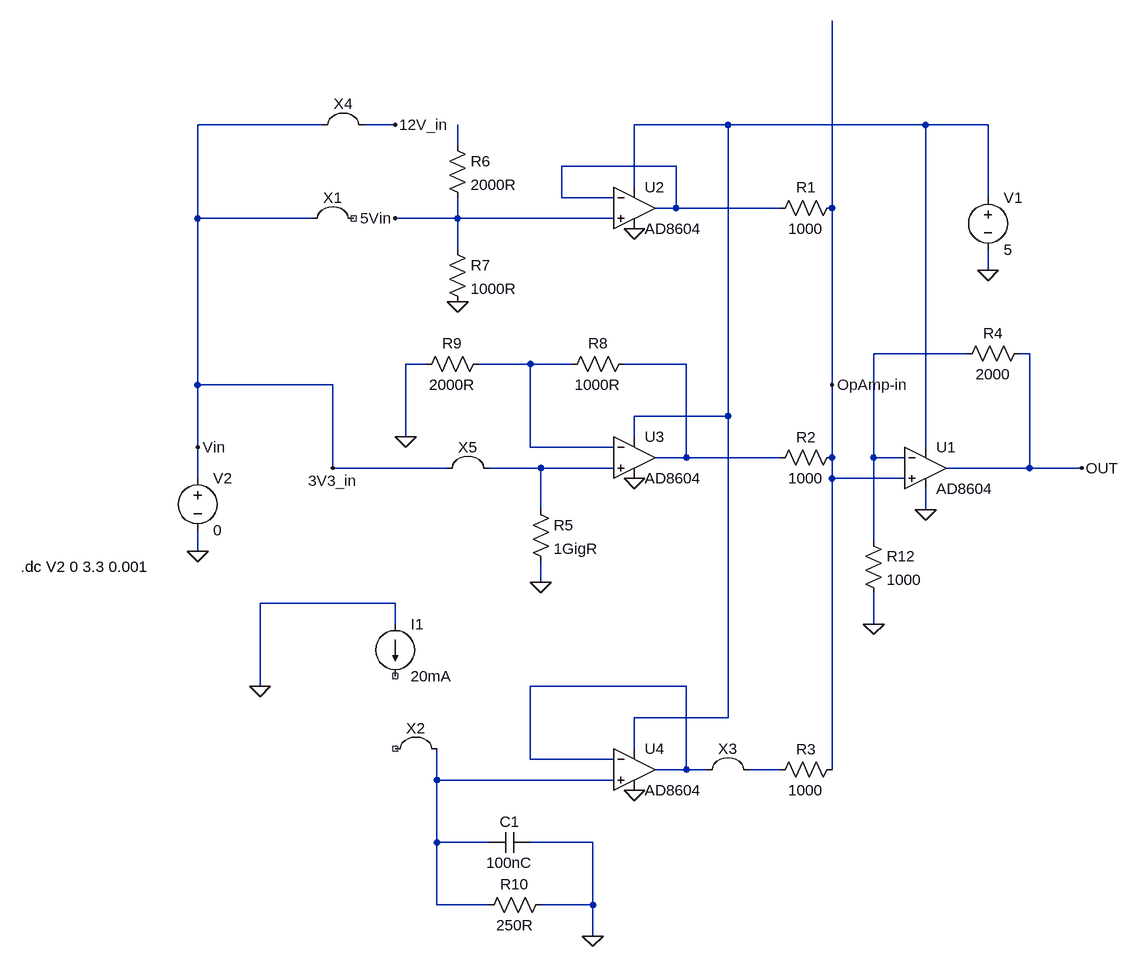
[diagram p0: schematic LM234-OpAmp-LTSpice.asc]
LM234-OpAmp-LTSpice.asc, the LTspice schematic file:
Version 4
SHEET 1 1060 1028
WIRE -432 -384 -624 -384
WIRE -320 -384 -368 -384
WIRE 192 -384 48 -384
WIRE 496 -384 192 -384
WIRE 592 -384 496 -384
WIRE -224 -352 -224 -384
WIRE 112 -320 -64 -320
WIRE 48 -288 48 -384
WIRE -64 -272 -64 -320
WIRE 16 -272 -64 -272
WIRE 592 -272 592 -384
WIRE 112 -256 112 -320
WIRE 112 -256 80 -256
WIRE 272 -256 112 -256
WIRE 352 -256 352 -544
WIRE -624 -240 -624 -384
WIRE -448 -240 -624 -240
WIRE -224 -240 -224 -272
WIRE -224 -240 -320 -240
WIRE 16 -240 -224 -240
WIRE -224 -192 -224 -240
WIRE 592 -160 592 -192
WIRE 560 -32 416 -32
WIRE 656 -32 640 -32
WIRE -272 -16 -304 -16
WIRE -112 -16 -192 -16
WIRE -48 -16 -112 -16
WIRE 128 -16 32 -16
WIRE -624 16 -624 -240
WIRE -416 16 -624 16
WIRE 352 16 352 -256
WIRE 192 64 192 -384
WIRE 192 64 48 64
WIRE -304 96 -304 -16
WIRE 48 96 48 64
WIRE -624 112 -624 16
WIRE -112 112 -112 -16
WIRE 16 112 -112 112
WIRE 496 112 496 -384
WIRE 128 128 128 -16
WIRE 128 128 80 128
WIRE 272 128 128 128
WIRE 352 128 352 16
WIRE 416 128 416 -32
WIRE 464 128 416 128
WIRE -416 144 -416 16
WIRE -240 144 -416 144
WIRE -96 144 -176 144
WIRE 16 144 -96 144
WIRE 656 144 656 -32
WIRE 656 144 528 144
WIRE 736 144 656 144
WIRE -624 160 -624 112
WIRE 352 160 352 128
WIRE 464 160 352 160
WIRE -96 208 -96 144
WIRE 496 208 496 176
WIRE 416 256 416 128
WIRE -624 272 -624 240
WIRE -96 320 -96 288
WIRE -320 352 -528 352
WIRE -320 384 -320 352
WIRE 416 384 416 336
WIRE -528 480 -528 352
WIRE 128 480 -112 480
WIRE 192 528 192 64
WIRE 192 528 48 528
WIRE 48 576 48 528
WIRE -112 592 -112 480
WIRE 16 592 -112 592
WIRE 128 608 128 480
WIRE 128 608 80 608
WIRE 160 608 128 608
WIRE 272 608 224 608
WIRE 352 608 352 160
WIRE -256 624 -256 576
WIRE 16 624 -256 624
WIRE -256 720 -256 624
WIRE -176 720 -256 720
WIRE -16 720 -112 720
WIRE -256 816 -256 720
WIRE -176 816 -256 816
WIRE -16 816 -16 720
WIRE -16 816 -96 816
WIRE -16 864 -16 816
FLAG 496 208 0
FLAG 592 -160 0
FLAG 48 -224 0
FLAG 48 160 0
FLAG 48 640 0
FLAG -624 272 0
FLAG -224 -112 0
FLAG 736 144 OUT
FLAG -624 112 Vin
FLAG 352 16 OpAmp-in
FLAG -304 96 0
FLAG -320 -384 12V_in
FLAG -320 -240 5Vin
FLAG -416 144 3V3_in
FLAG -528 480 0
FLAG 416 384 0
FLAG -16 864 0
FLAG -96 320 0
SYMBOL res 368 -272 R90
WINDOW 0 0 56 VBottom 2
WINDOW 3 32 56 VTop 2
SYMATTR InstName R1
SYMATTR Value 1000
SYMBOL res 368 112 R90
WINDOW 0 0 56 VBottom 2
WINDOW 3 32 56 VTop 2
SYMATTR InstName R2
SYMATTR Value 1000
SYMBOL res 368 592 R90
WINDOW 0 0 56 VBottom 2
WINDOW 3 32 56 VTop 2
SYMATTR InstName R3
SYMATTR Value 1000
SYMBOL voltage 592 -288 R0
WINDOW 123 0 0 Left 0
WINDOW 39 0 0 Left 0
SYMATTR InstName V1
SYMATTR Value 5
SYMBOL res 656 -48 R90
WINDOW 0 0 56 VBottom 2
WINDOW 3 32 56 VTop 2
SYMATTR InstName R4
SYMATTR Value 2000
SYMBOL voltage -624 144 R0
WINDOW 123 0 0 Left 0
WINDOW 39 0 0 Left 0
SYMATTR InstName V2
SYMATTR Value 0
SYMBOL res -240 -368 R0
SYMATTR InstName R6
SYMATTR Value 2000R
SYMBOL res -240 -208 R0
SYMATTR InstName R7
SYMATTR Value 1000R
SYMBOL res 48 -32 R90
WINDOW 0 0 56 VBottom 2
WINDOW 3 32 56 VTop 2
SYMATTR InstName R8
SYMATTR Value 1000R
SYMBOL res -176 -32 R90
WINDOW 0 0 56 VBottom 2
WINDOW 3 32 56 VTop 2
SYMATTR InstName R9
SYMATTR Value 2000R
SYMBOL res -80 800 R90
WINDOW 0 0 56 VBottom 2
WINDOW 3 32 56 VTop 2
SYMATTR InstName R10
SYMATTR Value 250R
SYMBOL cap -112 704 R90
WINDOW 0 0 32 VBottom 2
WINDOW 3 32 32 VTop 2
SYMATTR InstName C1
SYMATTR Value 100nC
SYMBOL current -320 384 R0
WINDOW 123 0 0 Left 0
WINDOW 39 0 0 Left 0
SYMATTR InstName I1
SYMATTR Value 20mA
SYMBOL Misc\\jumper 192 544 R0
SYMATTR InstName X3
SYMBOL res 400 240 R0
SYMATTR InstName R12
SYMATTR Value 1000
SYMBOL OpAmps\\AD8604 48 544 R0
SYMATTR InstName U4
SYMBOL OpAmps\\AD8604 496 80 R0
SYMATTR InstName U1
SYMBOL OpAmps\\AD8604 48 -320 R0
SYMATTR InstName U2
SYMBOL OpAmps\\AD8604 48 64 R0
SYMATTR InstName U3
SYMBOL Misc\\jumper -416 -304 R0
SYMATTR InstName X1
SYMBOL Misc\\jumper -400 -448 R0
SYMATTR InstName X4
SYMBOL Misc\\jumper -208 80 R0
SYMATTR InstName X5
SYMBOL Misc\\jumper -288 512 R0
SYMATTR InstName X2
SYMBOL res -112 192 R0
SYMATTR InstName R5
SYMATTR Value 1GigR
TEXT -896 296 Left 2 !.dc V2 0 3.3 0.001

The netlist it stands for:
* LM234-OpAmp-LTSpice.asc
R1 OpAmp-in N003 1000
R2 OpAmp-in N006 1000
R3 OpAmp-in N007 1000
V1 N001 0 5
R4 OUT N004 2000
V2 3V3_in 0 0
R6 N002 5Vin 2000R
R7 5Vin 0 1000R
R8 N006 N005 1000R
R9 N005 0 2000R
R10 0 N008 250R
C1 0 N008 100nC
I1 0 NC_01 20mA
R12 N004 0 1000
XU4 N008 N007 N001 0 N007 AD8604  ; pins In+ In- V+ V- OUT
XU1 OpAmp-in N004 N001 0 OUT AD8604  ; pins In+ In- V+ V- OUT
XU2 5Vin N003 N001 0 N003 AD8604  ; pins In+ In- V+ V- OUT
XU3 3V3_in N005 N001 0 N006 AD8604  ; pins In+ In- V+ V- OUT
R5 3V3_in 0 1GigR
.dc V2 0 3.3 0.001
.backanno
.end